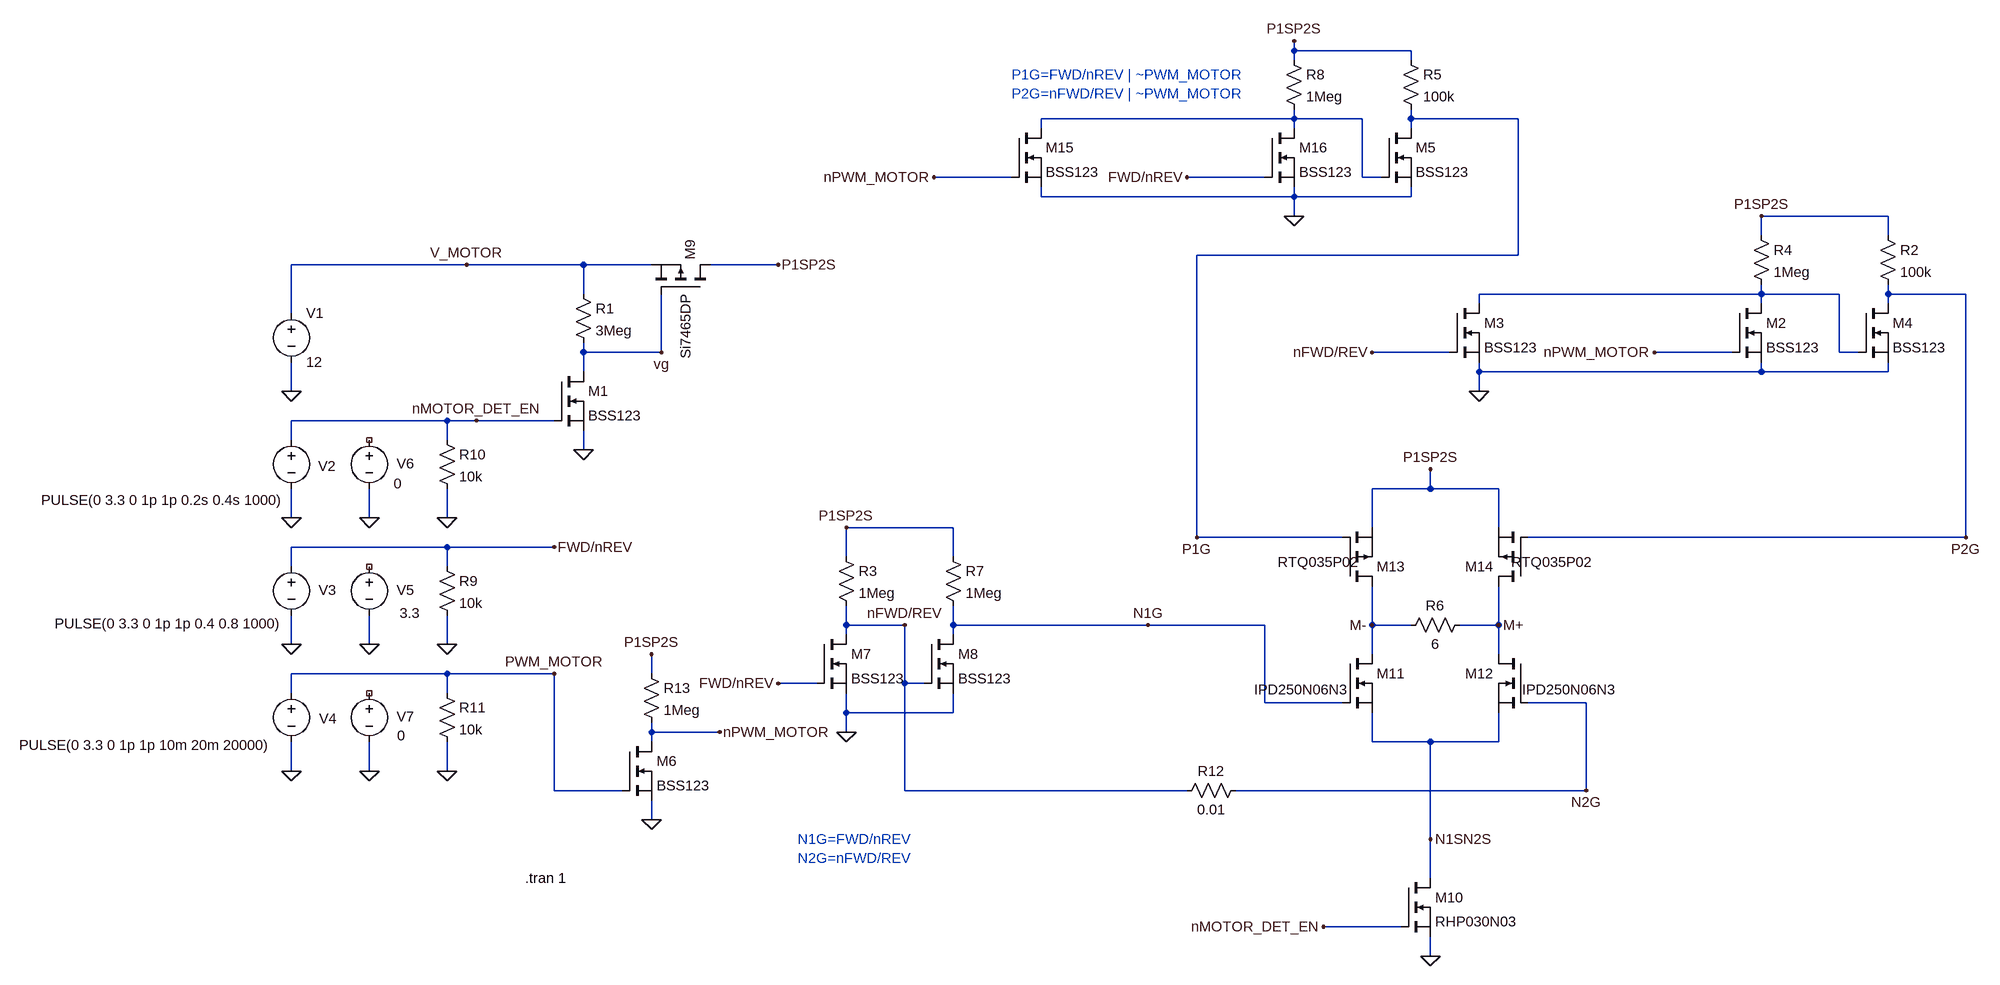
[diagram p0: schematic H-bridge.asc]
H-bridge.asc, the LTspice schematic file:
Version 4
SHEET 1 2488 1236
WIRE 1344 -1472 1344 -1488
WIRE 1536 -1472 1344 -1472
WIRE 1344 -1456 1344 -1472
WIRE 1536 -1456 1536 -1472
WIRE 1344 -1360 1344 -1376
WIRE 1344 -1360 928 -1360
WIRE 1456 -1360 1344 -1360
WIRE 1536 -1360 1536 -1376
WIRE 1712 -1360 1536 -1360
WIRE 928 -1344 928 -1360
WIRE 1344 -1344 1344 -1360
WIRE 1536 -1344 1536 -1360
WIRE 880 -1264 752 -1264
WIRE 1296 -1264 1168 -1264
WIRE 1456 -1264 1456 -1360
WIRE 1488 -1264 1456 -1264
WIRE 928 -1232 928 -1248
WIRE 1344 -1232 1344 -1248
WIRE 1344 -1232 928 -1232
WIRE 1536 -1232 1536 -1248
WIRE 1536 -1232 1344 -1232
WIRE 1344 -1200 1344 -1232
WIRE 2320 -1200 2112 -1200
WIRE 2112 -1168 2112 -1200
WIRE 2320 -1168 2320 -1200
WIRE 1712 -1136 1712 -1360
WIRE 1712 -1136 1184 -1136
WIRE -16 -1120 -304 -1120
WIRE 176 -1120 -16 -1120
WIRE 288 -1120 176 -1120
WIRE 496 -1120 384 -1120
WIRE 176 -1072 176 -1120
WIRE 2112 -1072 2112 -1088
WIRE 2112 -1072 1648 -1072
WIRE 2240 -1072 2112 -1072
WIRE 2320 -1072 2320 -1088
WIRE 2448 -1072 2320 -1072
WIRE 1648 -1056 1648 -1072
WIRE 2112 -1056 2112 -1072
WIRE 2320 -1056 2320 -1072
WIRE -304 -1040 -304 -1120
WIRE 176 -976 176 -992
WIRE 304 -976 304 -1072
WIRE 304 -976 176 -976
WIRE 1600 -976 1472 -976
WIRE 2064 -976 1936 -976
WIRE 2240 -976 2240 -1072
WIRE 2272 -976 2240 -976
WIRE 176 -944 176 -976
WIRE 1648 -944 1648 -960
WIRE 2112 -944 2112 -960
WIRE 2112 -944 1648 -944
WIRE 2320 -944 2320 -960
WIRE 2320 -944 2112 -944
WIRE -304 -912 -304 -960
WIRE 1648 -912 1648 -944
WIRE -48 -864 -304 -864
WIRE 0 -864 -48 -864
WIRE 128 -864 0 -864
WIRE -304 -832 -304 -864
WIRE -48 -832 -48 -864
WIRE 176 -816 176 -848
WIRE 1568 -752 1568 -784
WIRE 1568 -752 1472 -752
WIRE 1680 -752 1568 -752
WIRE -304 -704 -304 -752
WIRE -176 -704 -176 -752
WIRE -48 -704 -48 -752
WIRE 784 -688 608 -688
WIRE 1472 -688 1472 -752
WIRE 1680 -688 1680 -752
WIRE 1184 -672 1184 -1136
WIRE 1424 -672 1184 -672
WIRE 2448 -672 2448 -1072
WIRE 2448 -672 1728 -672
WIRE -48 -656 -304 -656
WIRE 128 -656 -48 -656
WIRE 608 -640 608 -688
WIRE 784 -640 784 -688
WIRE -304 -624 -304 -656
WIRE -48 -624 -48 -656
WIRE 608 -528 608 -560
WIRE 704 -528 608 -528
WIRE 784 -528 784 -560
WIRE 1104 -528 784 -528
WIRE 1296 -528 1104 -528
WIRE 1472 -528 1472 -592
WIRE 1536 -528 1472 -528
WIRE 1680 -528 1680 -592
WIRE 1680 -528 1616 -528
WIRE 608 -512 608 -528
WIRE 784 -512 784 -528
WIRE -304 -496 -304 -544
WIRE -176 -496 -176 -544
WIRE -48 -496 -48 -544
WIRE 1472 -480 1472 -528
WIRE 1680 -480 1680 -528
WIRE -48 -448 -304 -448
WIRE 128 -448 -48 -448
WIRE 288 -448 288 -480
WIRE 560 -432 496 -432
WIRE 704 -432 704 -528
WIRE 736 -432 704 -432
WIRE -304 -416 -304 -448
WIRE -48 -416 -48 -448
WIRE 1296 -400 1296 -528
WIRE 1424 -400 1296 -400
WIRE 1824 -400 1728 -400
WIRE 608 -384 608 -416
WIRE 784 -384 784 -416
WIRE 784 -384 608 -384
WIRE 288 -352 288 -368
WIRE 400 -352 288 -352
WIRE 608 -352 608 -384
WIRE 288 -336 288 -352
WIRE 1472 -336 1472 -384
WIRE 1568 -336 1472 -336
WIRE 1680 -336 1680 -384
WIRE 1680 -336 1568 -336
WIRE -304 -288 -304 -336
WIRE -176 -288 -176 -336
WIRE -48 -288 -48 -336
WIRE 128 -256 128 -448
WIRE 240 -256 128 -256
WIRE 704 -256 704 -432
WIRE 1168 -256 704 -256
WIRE 1824 -256 1824 -400
WIRE 1824 -256 1248 -256
WIRE 288 -208 288 -240
WIRE 1568 -176 1568 -336
WIRE 1568 -112 1568 -176
WIRE 1520 -32 1392 -32
WIRE 1568 16 1568 -16
FLAG 128 -448 PWM_MOTOR
FLAG 0 -864 nMOTOR_DET_EN
FLAG -304 -912 0
FLAG -16 -1120 V_MOTOR
FLAG 1568 -784 P1SP2S
FLAG 1104 -528 N1G
FLAG -304 -704 0
FLAG -304 -496 0
FLAG -304 -288 0
FLAG 176 -816 0
FLAG 2448 -672 P2G
FLAG -48 -496 0
FLAG -48 -704 0
FLAG -48 -288 0
FLAG 1568 16 0
FLAG 1568 -176 N1SN2S
FLAG 304 -976 vg
FLAG -176 -288 0
FLAG -176 -496 0
FLAG -176 -704 0
FLAG 1648 -912 0
FLAG 1936 -976 nPWM_MOTOR
FLAG 1680 -528 M+
FLAG 1472 -528 M-
FLAG 1472 -976 nFWD/REV
FLAG 2112 -1200 P1SP2S
FLAG 496 -1120 P1SP2S
FLAG 1392 -32 nMOTOR_DET_EN
FLAG 608 -352 0
FLAG 608 -688 P1SP2S
FLAG 1184 -672 P1G
FLAG 704 -528 nFWD/REV
FLAG 1344 -1200 0
FLAG 752 -1264 nPWM_MOTOR
FLAG 1168 -1264 FWD/nREV
FLAG 1344 -1488 P1SP2S
FLAG 496 -432 FWD/nREV
FLAG 128 -656 FWD/nREV
FLAG 1824 -256 N2G
FLAG 288 -480 P1SP2S
FLAG 288 -208 0
FLAG 400 -352 nPWM_MOTOR
SYMBOL nmos 128 -944 R0
SYMATTR InstName M1
SYMATTR Value BSS123
SYMBOL nmos 2064 -1056 R0
SYMATTR InstName M2
SYMATTR Value BSS123
SYMBOL nmos 1600 -1056 R0
SYMATTR InstName M3
SYMATTR Value BSS123
SYMBOL res 160 -1088 R0
SYMATTR InstName R1
SYMATTR Value 3Meg
SYMBOL res 2096 -1184 R0
SYMATTR InstName R4
SYMATTR Value 1Meg
SYMBOL voltage -304 -1056 R0
WINDOW 123 0 0 Left 0
WINDOW 39 0 0 Left 0
SYMATTR InstName V1
SYMATTR Value 12
SYMBOL voltage -304 -848 R0
WINDOW 0 44 59 Left 2
WINDOW 3 -411 115 Left 2
WINDOW 123 0 0 Left 0
WINDOW 39 0 0 Left 0
SYMATTR InstName V2
SYMATTR Value PULSE(0 3.3 0 1p 1p 0.2s 0.4s 1000)
SYMBOL voltage -304 -640 R0
WINDOW 0 45 55 Left 2
WINDOW 3 -389 110 Left 2
WINDOW 123 0 0 Left 0
WINDOW 39 0 0 Left 0
SYMATTR InstName V3
SYMATTR Value PULSE(0 3.3 0 1p 1p 0.4 0.8 1000)
SYMBOL voltage -304 -432 R0
WINDOW 0 46 58 Left 2
WINDOW 3 -447 102 Left 2
WINDOW 123 0 0 Left 0
WINDOW 39 0 0 Left 0
SYMATTR InstName V4
SYMATTR Value PULSE(0 3.3 0 1p 1p 10m 20m 20000)
SYMBOL res -64 -640 R0
SYMATTR InstName R9
SYMATTR Value 10k
SYMBOL res -64 -848 R0
SYMATTR InstName R10
SYMATTR Value 10k
SYMBOL res -64 -432 R0
SYMATTR InstName R11
SYMATTR Value 10k
SYMBOL nmos 1520 -112 R0
SYMATTR InstName M10
SYMATTR Value RHP030N03
SYMBOL nmos 1424 -480 R0
WINDOW 3 -146 58 Left 2
SYMATTR Value IPD250N06N3
SYMATTR InstName M11
SYMBOL pmos 384 -1072 M270
WINDOW 3 -107 39 Left 2
SYMATTR Value Si7465DP
SYMATTR InstName M9
SYMBOL pmos 1424 -592 M180
WINDOW 3 -107 39 Left 2
SYMATTR Value RTQ035P02
SYMATTR InstName M13
SYMBOL nmos 1728 -480 M0
WINDOW 3 -146 58 Left 2
SYMATTR Value IPD250N06N3
SYMATTR InstName M12
SYMBOL pmos 1728 -592 R180
WINDOW 3 -107 39 Left 2
SYMATTR Value RTQ035P02
SYMATTR InstName M14
SYMBOL voltage -176 -640 R0
WINDOW 0 45 55 Left 2
WINDOW 3 50 93 Left 2
WINDOW 123 0 0 Left 0
WINDOW 39 0 0 Left 0
SYMATTR InstName V5
SYMATTR Value 3.3
SYMBOL voltage -176 -848 R0
WINDOW 0 45 55 Left 2
WINDOW 3 40 88 Left 2
WINDOW 123 0 0 Left 0
WINDOW 39 0 0 Left 0
SYMATTR InstName V6
SYMATTR Value 0
SYMBOL voltage -176 -432 R0
WINDOW 0 45 55 Left 2
WINDOW 3 46 86 Left 2
WINDOW 123 0 0 Left 0
WINDOW 39 0 0 Left 0
SYMATTR InstName V7
SYMATTR Value 0
SYMBOL res 1632 -544 R90
WINDOW 0 0 56 VBottom 2
WINDOW 3 32 56 VTop 2
SYMATTR InstName R6
SYMATTR Value 6
SYMBOL nmos 560 -512 R0
SYMATTR InstName M7
SYMATTR Value BSS123
SYMBOL nmos 736 -512 R0
SYMATTR InstName M8
SYMATTR Value BSS123
SYMBOL res 592 -656 R0
SYMATTR InstName R3
SYMATTR Value 1Meg
SYMBOL res 768 -656 R0
SYMATTR InstName R7
SYMATTR Value 1Meg
SYMBOL nmos 880 -1344 R0
SYMATTR InstName M15
SYMATTR Value BSS123
SYMBOL nmos 1296 -1344 R0
SYMATTR InstName M16
SYMATTR Value BSS123
SYMBOL res 1328 -1472 R0
SYMATTR InstName R8
SYMATTR Value 1Meg
SYMBOL nmos 2272 -1056 R0
SYMATTR InstName M4
SYMATTR Value BSS123
SYMBOL res 2304 -1184 R0
SYMATTR InstName R2
SYMATTR Value 100k
SYMBOL nmos 1488 -1344 R0
SYMATTR InstName M5
SYMATTR Value BSS123
SYMBOL res 1520 -1472 R0
SYMATTR InstName R5
SYMATTR Value 100k
SYMBOL res 1264 -272 R90
WINDOW 0 0 56 VBottom 2
WINDOW 3 32 56 VTop 2
SYMATTR InstName R12
SYMATTR Value 0.01
SYMBOL nmos 240 -336 R0
SYMATTR InstName M6
SYMATTR Value BSS123
SYMBOL res 272 -464 R0
SYMATTR InstName R13
SYMATTR Value 1Meg
TEXT 80 -112 Left 2 !.tran 1
TEXT 880 -1432 Left 2 ;P1G=FWD/nREV | ~PWM_MOTOR\nP2G=nFWD/REV | ~PWM_MOTOR
TEXT 528 -176 Left 2 ;N1G=FWD/nREV\nN2G=nFWD/REV

The netlist it stands for:
* H-bridge.asc
M1 vg nMOTOR_DET_EN 0 0 BSS123
M2 N002 nPWM_MOTOR 0 0 BSS123
M3 N002 nFWD/REV 0 0 BSS123
R1 V_MOTOR vg 3Meg
R4 P1SP2S N002 1Meg
V1 V_MOTOR 0 12
V2 nMOTOR_DET_EN 0 PULSE(0 3.3 0 1p 1p 0.2s 0.4s 1000)
V3 FWD/nREV 0 PULSE(0 3.3 0 1p 1p 0.4 0.8 1000)
V4 PWM_MOTOR 0 PULSE(0 3.3 0 1p 1p 10m 20m 20000)
R9 FWD/nREV 0 10k
R10 nMOTOR_DET_EN 0 10k
R11 PWM_MOTOR 0 10k
M10 N1SN2S nMOTOR_DET_EN 0 0 RHP030N03
M11 M- N1G N1SN2S N1SN2S IPD250N06N3
M9 P1SP2S vg V_MOTOR V_MOTOR Si7465DP
M13 M- P1G P1SP2S P1SP2S RTQ035P02
M12 M+ N2G N1SN2S N1SN2S IPD250N06N3
M14 M+ P2G P1SP2S P1SP2S RTQ035P02
V5 NC_01 0 3.3
V6 NC_02 0 0
V7 NC_03 0 0
R6 M+ M- 6
M7 nFWD/REV FWD/nREV 0 0 BSS123
M8 N1G nFWD/REV 0 0 BSS123
R3 P1SP2S nFWD/REV 1Meg
R7 P1SP2S N1G 1Meg
M15 N001 nPWM_MOTOR 0 0 BSS123
M16 N001 FWD/nREV 0 0 BSS123
R8 P1SP2S N001 1Meg
M4 P2G N002 0 0 BSS123
R2 P1SP2S P2G 100k
M5 P1G N001 0 0 BSS123
R5 P1SP2S P1G 100k
R12 N2G nFWD/REV 0.01
M6 nPWM_MOTOR PWM_MOTOR 0 0 BSS123
R13 P1SP2S nPWM_MOTOR 1Meg
.model NMOS NMOS
.model PMOS PMOS
.lib standard.mos
.tran 1
* P1G=FWD/nREV | ~PWM_MOTOR
* P2G=nFWD/REV | ~PWM_MOTOR
* N1G=FWD/nREV
* N2G=nFWD/REV
.backanno
.end